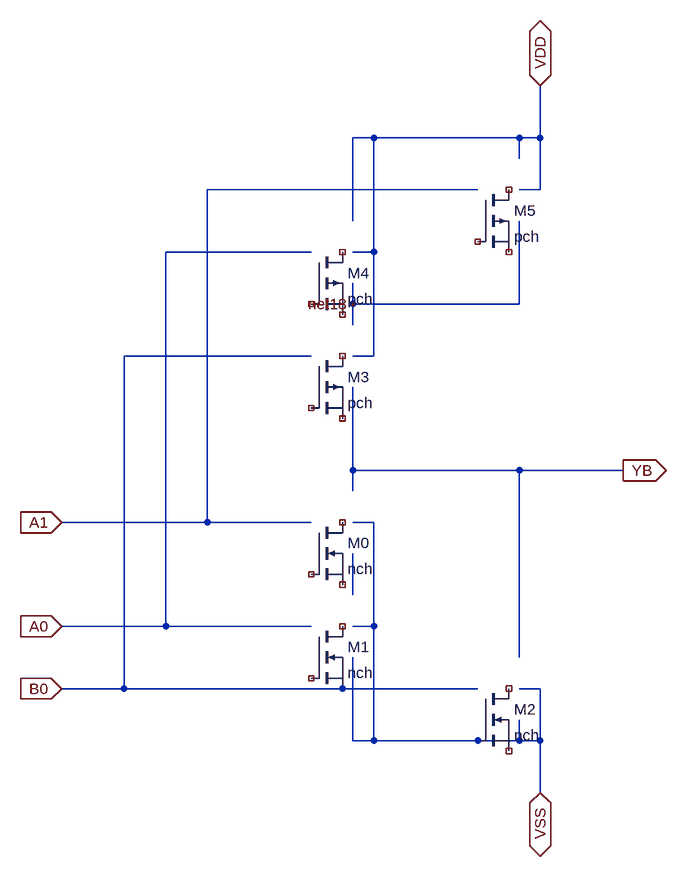
[diagram p0: schematic nr212.asc]
nr212.asc, the LTspice schematic file:
Version 4
SHEET 1 1040 1280
WIRE 800 688 960 688
WIRE 800 976 800 688
WIRE 544 688 800 688
WIRE 544 688 544 560
WIRE 544 720 544 688
WIRE 192 512 480 512
WIRE 192 1024 192 512
WIRE 192 1024 736 1024
WIRE 96 1024 192 1024
WIRE 800 432 800 304
WIRE 544 432 800 432
WIRE 544 432 544 400
WIRE 544 464 544 432
WIRE 832 1104 832 1184
WIRE 800 1104 832 1104
WIRE 832 1104 832 1024
WIRE 800 1024 832 1024
WIRE 576 928 576 768
WIRE 544 768 576 768
WIRE 576 1104 576 928
WIRE 576 1104 800 1104
WIRE 544 928 576 928
WIRE 800 1104 800 1072
WIRE 544 1104 576 1104
WIRE 544 1104 544 976
WIRE 544 880 544 816
WIRE 256 928 480 928
WIRE 256 352 480 352
WIRE 256 928 256 352
WIRE 96 928 256 928
WIRE 320 256 736 256
WIRE 320 768 320 256
WIRE 320 768 480 768
WIRE 96 768 320 768
WIRE 832 176 832 96
WIRE 576 512 576 352
WIRE 544 512 576 512
WIRE 576 352 576 176
WIRE 576 176 800 176
WIRE 544 352 576 352
WIRE 800 176 832 176
WIRE 832 256 832 176
WIRE 800 256 832 256
WIRE 800 208 800 176
WIRE 544 176 576 176
WIRE 544 304 544 176
FLAG 544 432 net18
SYMBOL PMOS 736 256 R0
SYMATTR InstName M5
SYMATTR Value pch
SYMATTR Value2 w=6u l=1u
SYMBOL PMOS 480 352 R0
SYMATTR InstName M4
SYMATTR Value pch
SYMATTR Value2 w=6u l=1u
SYMBOL PMOS 480 512 R0
SYMATTR InstName M3
SYMATTR Value pch
SYMATTR Value2 w=6u l=1u
SYMBOL NMOS 736 1024 R0
SYMATTR InstName M2
SYMATTR Value nch
SYMATTR Value2 w=2u l=1u
SYMBOL NMOS 480 928 R0
SYMATTR InstName M1
SYMATTR Value nch
SYMATTR Value2 w=2u l=1u
SYMBOL NMOS 480 768 R0
SYMATTR InstName M0
SYMATTR Value nch
SYMATTR Value2 w=2u l=1u
FLAG 960 688 YB
IOPIN 960 688 Out
FLAG 832 1184 VSS
IOPIN 832 1184 BiDir
FLAG 832 96 VDD
IOPIN 832 96 BiDir
FLAG 96 1024 B0
IOPIN 96 1024 In
FLAG 96 768 A1
IOPIN 96 768 In
FLAG 96 928 A0
IOPIN 96 928 In

The netlist it stands for:
* nr212.asc
* M5: pch w=6u l=1u (symbol PMOS not certain, pin order unknown); nets seen at it: 
* M4: pch w=6u l=1u (symbol PMOS not certain, pin order unknown); nets seen at it: 
* M3: pch w=6u l=1u (symbol PMOS not certain, pin order unknown); nets seen at it: 
* M2: nch w=2u l=1u (symbol NMOS not certain, pin order unknown); nets seen at it: VSS
* M1: nch w=2u l=1u (symbol NMOS not certain, pin order unknown); nets seen at it: B0
* M0: nch w=2u l=1u (symbol NMOS not certain, pin order unknown); nets seen at it: 
.backanno
.end